# Altium project ANALOG_BOARD.PrjPcb
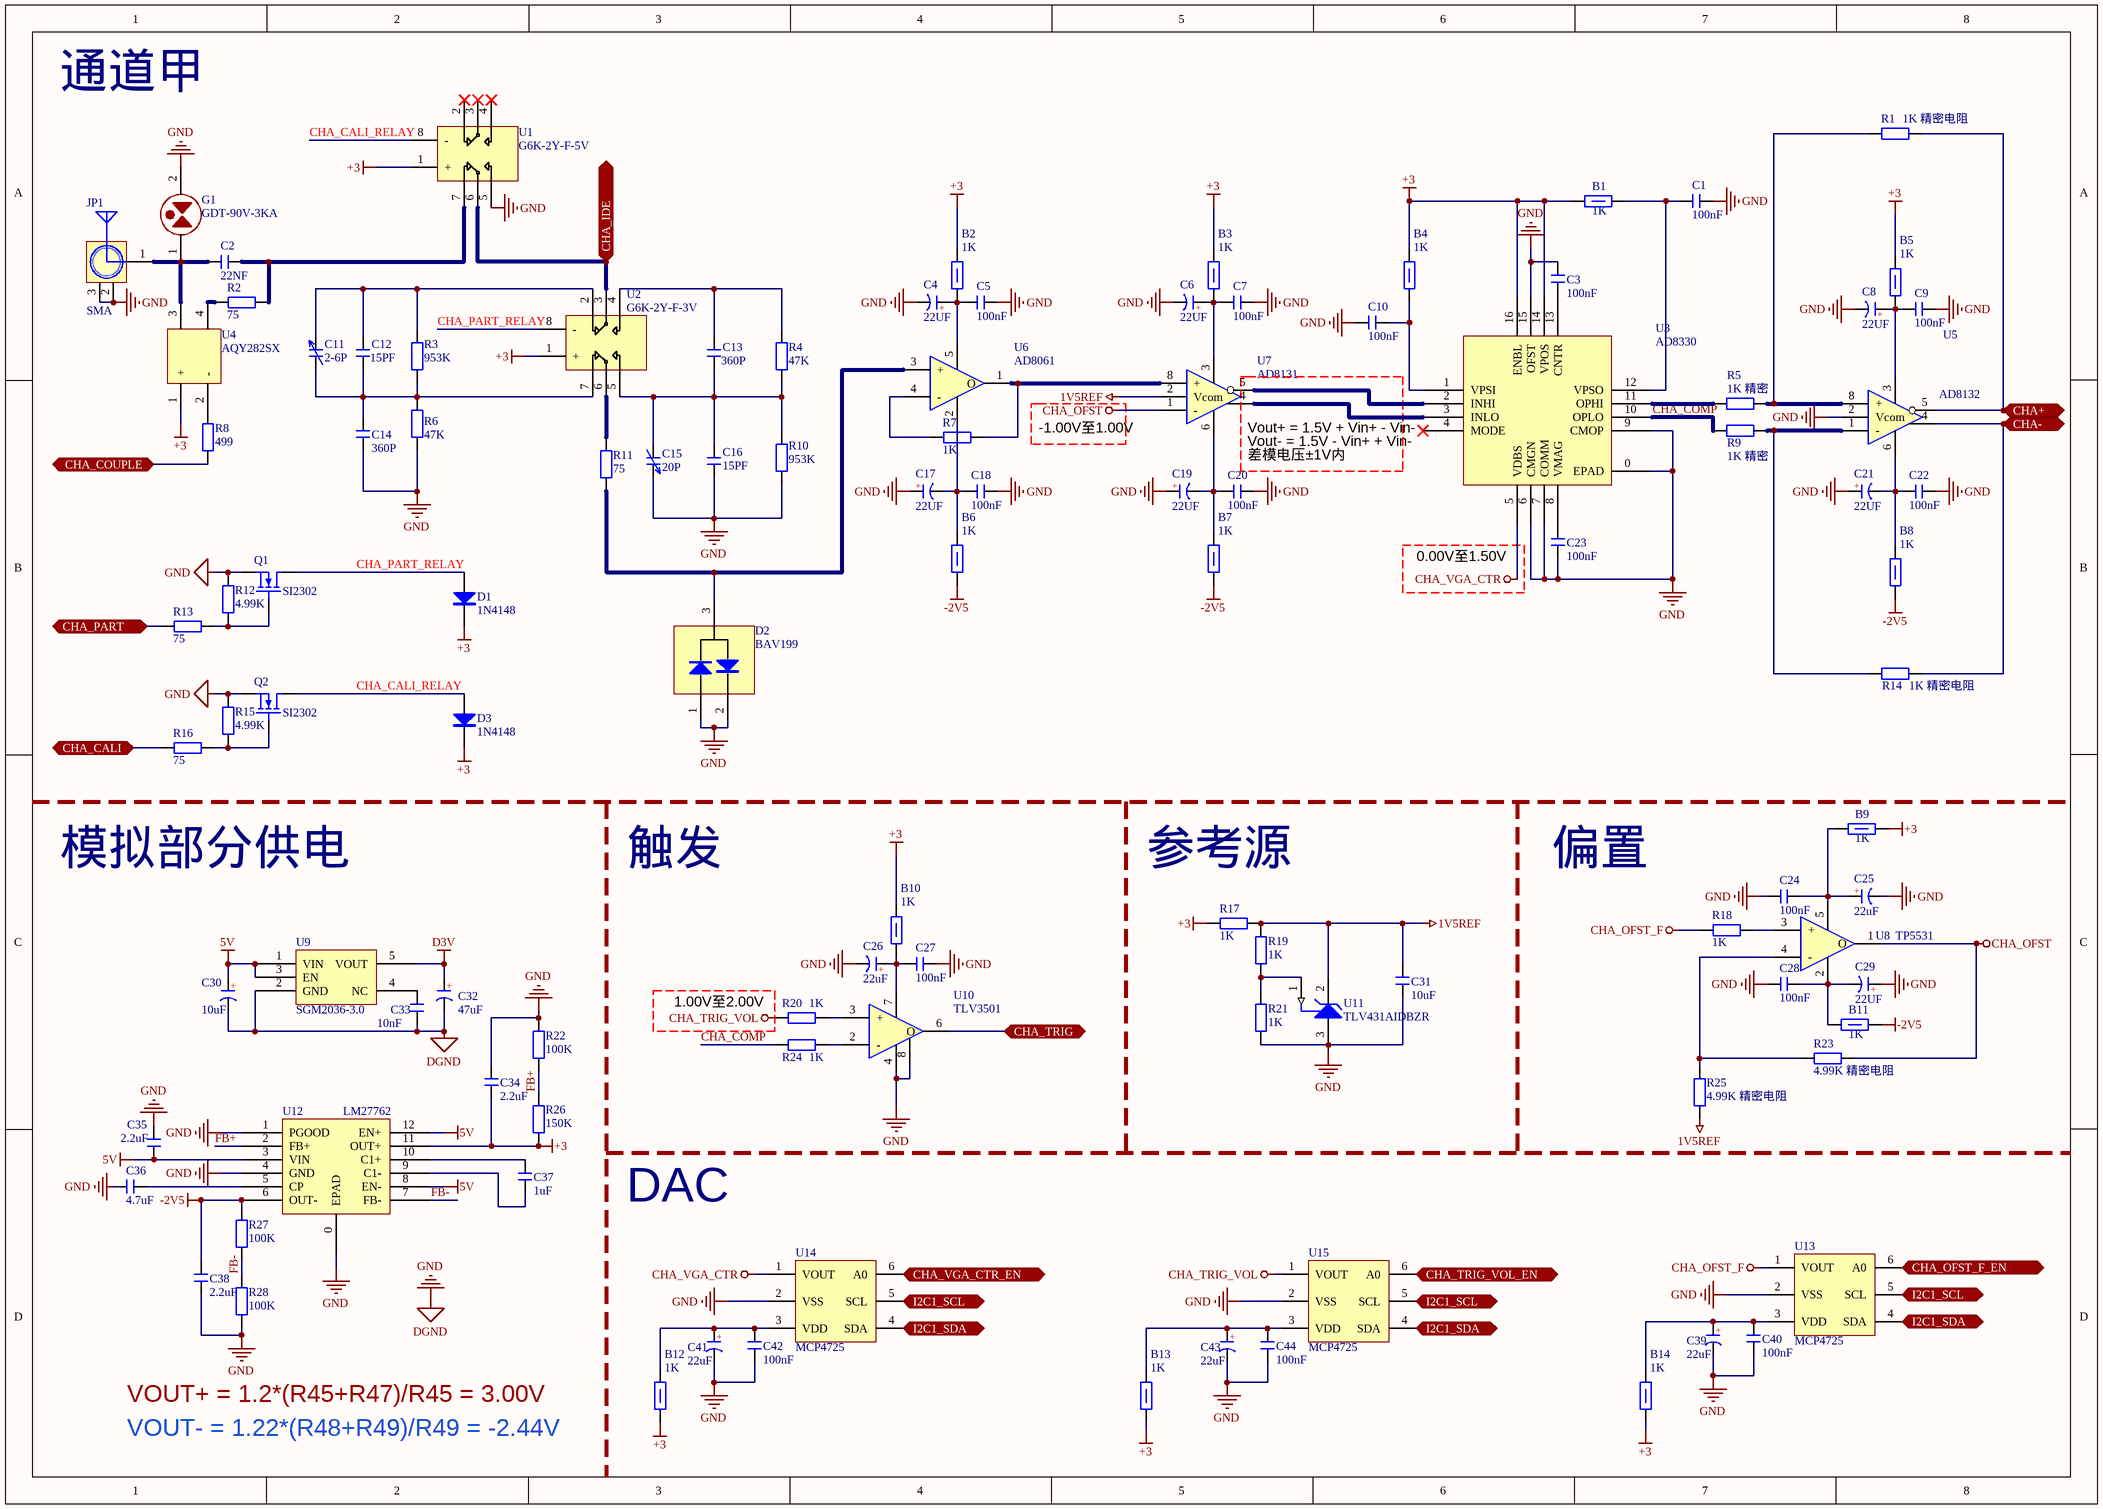
[diagram p0: ANALOG_PART1.SchDoc]
3 sheets, 241 parts. Net scope: flat (ports and power ports of the same name join across sheets).
Board file: ANALOG_BOARD.PcbDoc
Sheets:
  ANALOG_PART1.SchDoc
  ANALOG_PART2.SchDoc
  AtoD_PART.SchDoc

## Sheet ANALOG_PART1.SchDoc
size A3; SheetNumber: 1; SheetTotal: 3

### Parts
B1  1K  [B 0603_L]
B2  1K  [B 0603_L]
B3  1K  [B 0603_L]
B4  1K  [B 0603_L]
B5  1K  [B 0603_L]
B6  1K  [B 0603_L]
B7  1K  [B 0603_L]
B8  1K  [B 0603_L]
B9  1K  [B 0603_L]
B10  1K  [B 0603_L]
B11  1K  [B 0603_L]
B12  1K  [B 0603_L]
B13  1K  [B 0603_L]
B14  1K  [B 0603_L]
C1  100nF  [C 0603_L]
C2  22NF  [C 1206_L]
C3  100nF  [C 0603_L]
C4  22UF  [C 0603_L]
C5  100nF  [C 0603_L]
C6  22UF  [C 0603_L]
C7  100nF  [C 0603_L]
C8  22UF  [C 0603_L]
C9  100nF  [C 0603_L]
C10  100nF  [C 0603_L]
C11  2-6P  [RC-SMD]
C12  15PF  [C 0603_L]
C13  360P  [C 0603_L]
C14  360P  [C 0603_L]
C15  20P  [RC-SMD]
C16  15PF  [C 0603_L]
C17  22UF  [C 0603_L]
C18  100nF  [C 0603_L]
C19  22UF  [C 0603_L]
C20  100nF  [C 0603_L]
C21  22UF  [C 0603_L]
C22  100nF  [C 0603_L]
C23  100nF  [C 0603_L]
C24  100nF  [C 0603_L]
C25  22uF  [C 0603_L]
C26  22uF  [C 0603_L]
C27  100nF  [C 0603_L]
C28  100nF  [C 0603_L]
C29  22UF  [C 0603_L]
C30  10uF  [CD A(3216)]
C31  10uF  [C 0603_L]
C32  47uF  [CD A(3216)]
C33  10nF  [C 0603_L]
C34  2.2uF  [C 0603_L]
C35  2.2uF  [C 0603_L]
C36  4.7uF  [C 0603_L]
C37  1uF  [C 0603_L]
C38  2.2uF  [C 0603_L]
C39  22uF  [C 0603_L]
C40  100nF  [C 0603_L]
C41  22uF  [C 0603_L]
C42  100nF  [C 0603_L]
C43  22uF  [C 0603_L]
C44  100nF  [C 0603_L]
D1  1N4148  [SOD-523_L]
D2  BAV199  [SOT23-3L]
D3  1N4148  [SOD-523_L]
G1  GDT-90V-3KA  [GDT-1812]
JP1  SMA  [SMA_FR]
Q1  SI2302  [SOT23-3L]
Q2  SI2302  [SOT23-3L]
R1  1K 精密电阻  [R 0603_L]
R2  75  [R 0603_L]
R3  953K  [R 0603_L]
R4  47K  [R 0603_L]
R5  1K 精密  [R 0603_L]
R6  47K  [R 0603_L]
R7  1K  [R 0603_L]
R8  499  [R 0603_L]
R9  1K 精密  [R 0603_L]
R10  953K  [R 0603_L]
R11  75  [R 0603_L]
R12  4.99K  [R 0603_L]
R13  75  [R 0603_L]
R14  1K 精密电阻  [R 0603_L]
R15  4.99K  [R 0603_L]
R16  75  [R 0603_L]
R17  1K  [R 0603_L]
R18  1K  [R 0603_L]
R19  1K  [R 0603_L]
R20  1K  [R 0603_L]
R21  1K  [R 0603_L]
R22  100K  [R 0603_L]
R23  4.99K 精密电阻  [R 0603_L]
R24  1K  [R 0603_L]
R25  4.99K 精密电阻  [R 0603_L]
R26  150K  [R 0603_L]
R27  100K  [R 0603_L]
R28  100K  [R 0603_L]
U1  G6K-2Y-F-5V  [G6K-2F-Y]
U2  G6K-2Y-F-3V  [G6K-2F-Y]
U3  AD8330  [LFCSP-16]
U4  AQY282SX  [SOP4_L]
U5  AD8132  [SOP8_L]
U6  AD8061  [SOT23-5]
U7  AD8131  [SOP8_L]
U8  TP5531  [SOT23-5]
U9  SGM2036-3.0  [SOT23-5L]
U10  TLV3501  [SOP8_L]
U11  TLV431AIDBZR  [DBZ0003A_N]
U12  LM27762  [WSON-12]
U13  MCP4725  [SOT23-6L]
U14  MCP4725  [SOT23-6L]
U15  MCP4725  [SOT23-6L]

### Ports
CHA+ (bidir), CHA- (bidir), CHA_CALI (bidir), CHA_COUPLE (bidir), CHA_IDE (bidir), CHA_OFST_F_EN (bidir), CHA_PART (bidir), CHA_TRIG (bidir), CHA_TRIG_VOL_EN (bidir), CHA_VGA_CTR_EN (bidir), I2C1_SCL (bidir), I2C1_SDA (bidir)

### Nets
1V5REF: C31.1 R17.2 R19.2 R25.2 U7.2(Vcom) U11.2(CATHODE)
5V: C30.1(A) C35.2 U9.1(VIN) U9.3(EN) U12.3(VIN) U12.8(EN-) U12.12(EN+)
+3: B1.1 B2.2 B3.2 B4.2 B5.2 B9.2 B10.2 B12.1 B13.1 B14.1 C34.1 D1.2(K) D3.2(K) R17.1 R26.1 U1.1(+) U2.1(+) U3.14(VPOS) U3.16(ENBL) U4.1(+) U12.11(OUT+)
-2V5: B6.1 B7.1 B8.1 B11.2 C38.1 R27.1 U12.6(OUT-)
CHA_OFST: R23.2 U7.1(-) U8.1(O)
CHA_OFST_F: R18.2 U13.1(VOUT)
CHA_TRIG_VOL: R20.1 U15.1(VOUT)
CHA_VGA_CTR: U3.5(VDBS) U14.1(VOUT)
D3V: C32.1(A) U9.5(VOUT)
DGND: C1.1 C3.1 C4.2(K) C5.1 C6.2(K) C7.1 C8.2(K) C9.1 C10.2 C14.1 C15.2 C16.1 C17.1(A) C18.1 C19.1(A) C20.1 C21.1(A) C22.1 C23.2 C24.2 C25.2(K) C26.2(K) C27.1 C28.2 C29.1(A) C30.2(K) C31.2 C32.2(K) C33.1 C34.2 C35.1 C36.1 C38.2 C39.2(K) C40.2 C41.2(K) C42.2 C43.2(K) C44.2 D2.1 D2.2 G1.2 JP1.2(GND) JP1.3(GND) Q1.2 Q2.2 R6.1 R10.1 R12.2 R15.2 R21.1 R22.2 R28.2 U1.5 U3.0(EPAD) U3.6(CMGN) U3.7(COMM) U3.9(CMOP) U3.15(OFST) U5.2(Vcom) U9.2(GND) U10.4 U10.8 U11.3(ANODE) U12.0(EPAD) U12.1(PGOOD) U12.4(GND) U13.2(VSS) U14.2(VSS) U15.2(VSS)  [also labelled GND]
CHA_CALI_RELAY: D3.1(A) Q2.3 U1.8(-)
CHA_COMP: R9.1 R24.1 U3.10(OPLO)
CHA_N: R14.2 U5.4 ; port CHA-
CHA_P: R1.2 U5.5 ; port CHA+
CHA_PART_RELAY: D1.1(A) Q1.3 U2.8(-)
FB+: R22.1 R26.2 U12.2(FB+)
FB-: R27.2 R28.1 U12.7(FB-)
Net1_15: U13.4(SDA) U14.4(SDA) U15.4(SDA) ; port I2C1_SDA
Net1_16: U13.5(SCL) U14.5(SCL) U15.5(SCL) ; port I2C1_SCL
Net1_25: U10.6(O) ; port CHA_TRIG
Net1_30: R16.2 ; port CHA_CALI
Net1_31: R8.1 ; port CHA_COUPLE
Net1_32: R13.2 ; port CHA_PART
NetB1_2: B1.2 C1.2 U3.12(VPSO)
NetB2_1: B2.1 C4.1(A) C5.2 U6.5
NetB3_1: B3.1 C6.1(A) C7.2 U7.3
NetB4_1: B4.1 C10.1 U3.1(VPSI)
NetB5_1: B5.1 C8.1(A) C9.2 U5.3
NetB6_2: B6.2 C17.2(K) C18.2 U6.2
NetB7_2: B7.2 C19.2(K) C20.2 U7.6
NetB8_2: B8.2 C21.2(K) C22.2 U5.6
NetB9_1: B9.1 C24.1 C25.1(A) U8.5
NetB10_1: B10.1 C26.1(A) C27.2 U10.7
NetB11_1: B11.1 C28.1 C29.2(K) U8.2
NetB12_2: B12.2 C41.1(A) C42.1 U14.3(VDD)
NetB13_2: B13.2 C43.1(A) C44.1 U15.3(VDD)
NetB14_2: B14.2 C39.1(A) C40.1 U13.3(VDD)
NetC2_1: C2.1 G1.1 JP1.1(ANT) U4.3
NetC2_2: C2.2 R2.2 U1.7
NetC3_2: C3.2 U3.13(CNTR)
NetC11_1: C11.1 C12.1 C14.2 R3.1 R6.2 U2.7
NetC11_2: C11.2 C12.2 R3.2 U2.2
NetC13_1: C13.1 C15.1 C16.2 R4.1 R10.2 U2.5
NetC13_2: C13.2 R4.2 U2.4
NetC23_1: C23.1 U3.8(VMAG)
NetC33_2: C33.2 U9.4(NC)
NetC36_2: C36.2 U12.5(CP)
NetC37_1: C37.1 U12.10(C1+)
NetC37_2: C37.2 U12.9(C1-)
NetD2_3: D2.3 R11.1 U6.3(+)
NetIC1_13: U13.6(A0) ; port CHA_OFST_F_EN
NetIC1_14: U15.6(A0) ; port CHA_TRIG_VOL_EN
NetIC1_15: U14.6(A0) ; port CHA_VGA_CTR_EN
NetQ1_1: Q1.1 R12.1 R13.1
NetQ2_1: Q2.1 R15.1 R16.1
NetR1_1: R1.1 R5.2 U5.8(+)
NetR2_1: R2.1 U4.4
NetR5_1: R5.1 U3.11(OPHI)
NetR7_1: R7.1 U6.1(O) U7.8(+)
NetR7_2: R7.2 U6.4(-)
NetR8_2: R8.2 U4.2(-)
NetR9_2: R9.2 R14.1 U5.1(-)
NetR11_2: R11.2 U2.6
NetR18_1: R18.1 U8.3(+)
NetR19_1: R19.1 R21.2 U11.1(REF)
NetR20_2: R20.2 U10.3(+)
NetR23_1: R23.1 R25.1 U8.4(-)
NetR24_2: R24.2 U10.2(-)
NetU1_6: U1.6 U2.3 ; port CHA_IDE
NetU3_2: U3.2(INHI) U7.5
NetU3_3: U3.3(INLO) U7.4

Not connected (* = marked no-connect by the designer): U1 2* 3* 4*; U3 4(MODE)*

### Notes on the sheet
- 通道甲
- -1.00V至1.00V
- Vout+ = 1.5V + Vin+ - Vin-
- Vout- = 1.5V - Vin+ + Vin-
- 差模电压±1V内
- 0.00V至1.50V
- 模拟部分供电
- 触发
- 参考源
- 偏置
- 1.00V至2.00V
- DAC
- VOUT- = 1.22*(R48+R49)/R49 = -2.44V
- VOUT+ = 1.2*(R45+R47)/R45 = 3.00V
- (in symbol C-CD) +

### Library data of the parts
B1-B14 = B: 贴片磁珠
C1-C3 C5 C7 C9 C10 C12-C14 C16 C18 C20 C22-C24 C27 C28 C31 C33-C38 C40 C42 C44 = C: 无极性贴片电容; 版权归属: 源创客; BOM名称: 无极性贴片电容; 学习资源: www.ooocke.com
C4 C6 C8 C17 C19 C21 C25 C26 C29 C30 C32 C39 C41 C43 = C-CD: 贴片钽电容; 版权归属: 源创客; BOM名称: 贴片钽电容; 学习资源: www.ooocke.com
C11 C15 = CP_SMD: 贴片可调电容
D1 D3 = 1N4148: 高速开关二极管; 版权归属: 源创客; BOM名称: 高速开关二极管; 学习资源: www.ooocke.com
D2 = BAV199: 双肖特基二极管; BOM名称: 肖特基二极管; 版权归属: 源创客; 属性: 40V/2A; 学习资源: www.ooocke.com
G1 = GDT-90V-3KA: 气体放电管
JP1 = SMA: SMA-2.4G射频天线接口; 版权归属: 源创客; BOM名称: SMA-2.4G射频天线接口; 学习资源: www.ooocke.com
Q1 Q2 = SI2302: 场效应管
R1-R28 = R: 贴片电阻; 版权归属: 源创客; BOM名称: 贴片电阻; 学习资源: www.ooocke.com
U1 U2 = G6K-2Y-F-5V: 继电器
U3 = AD8330: 压控放大器
U4 = AQY282SX: 光电固态继电器
U5 = AD8132: 全差分运放; BOM名称: 单路精密运放; 版权归属: 源创客; 学习资源: www.ooocke.com
U6 = AD8061: FET输入运放; BOM名称: 单路精密运放; 版权归属: 源创客; 学习资源: www.ooocke.com
U7 = AD8131: 全差分运放; BOM名称: 单路精密运放; 版权归属: 源创客; 学习资源: www.ooocke.com
U8 = TP5531: 零漂运放; BOM名称: 单路精密运放; 版权归属: 源创客; 学习资源: www.ooocke.com
U9 = SP6201-3.3: 线性稳压器
U10 = TLV3501: 高速比较器; BOM名称: 单路精密运放; 版权归属: 源创客; 学习资源: www.ooocke.com
U11 = CMP-0366-00975-2: Low Voltage Adjustable Precision Shunt Regulator, 39 ppm / degC, 15 mA, -40 to 85 degC, 3-pin SOT-23 (DBZ), Green (RoHS & no Sb/Br); Manufacturer: Texas Instruments; Temp Coeff(Typ)(ppm/ degree C): 39; VO Adj(Max)(V): 6; SubFamily: Shunt Voltage Reference; Min Iz for Regulation(uA): 80; Temp Coeff(Max)(ppm/ degree C): 129; VO Adj(Min)(V): 1.24; Initial Accuracy @ 25/deg C(%): 1; Iout/Iz(Max)(mA): 15; Rating: Catalog; ComponentLink1URL: http://www.ti.com/; ComponentLink2URL: http://www.ti.com/general/docs/lit/getliterature.tsp?genericPartNumber=TLV431A&fileType=pdf; Mounting Technology: Surface Mount; DatasheetVersion: SLVS139T; ComponentLink3URL: http://www.ti.com/litv/pdf/mpds108a; PackageDescription: 3-Pin Plastic Small Outline, Body 2.92 x 1.3 mm, Pitch 0.95 mm; Code_JEDEC: TO-236; Eco-Plan: Green (RoHS & no Sb/Br); ComponentLink2Description: Datasheet; PackageReference: DBZ0003A; PackageVersion: 4203227/B; ComponentLink3Description: Package Specification; PartNumber: TLV431AIDBZR; ComponentLink1Description: Manufacturer URL
U12 = LM27762: DC-DC电源芯片
U13-U15 = MCP4725: 单通道DAC

## Sheet ANALOG_PART2.SchDoc
size A3; SheetNumber: 2; SheetTotal: 3
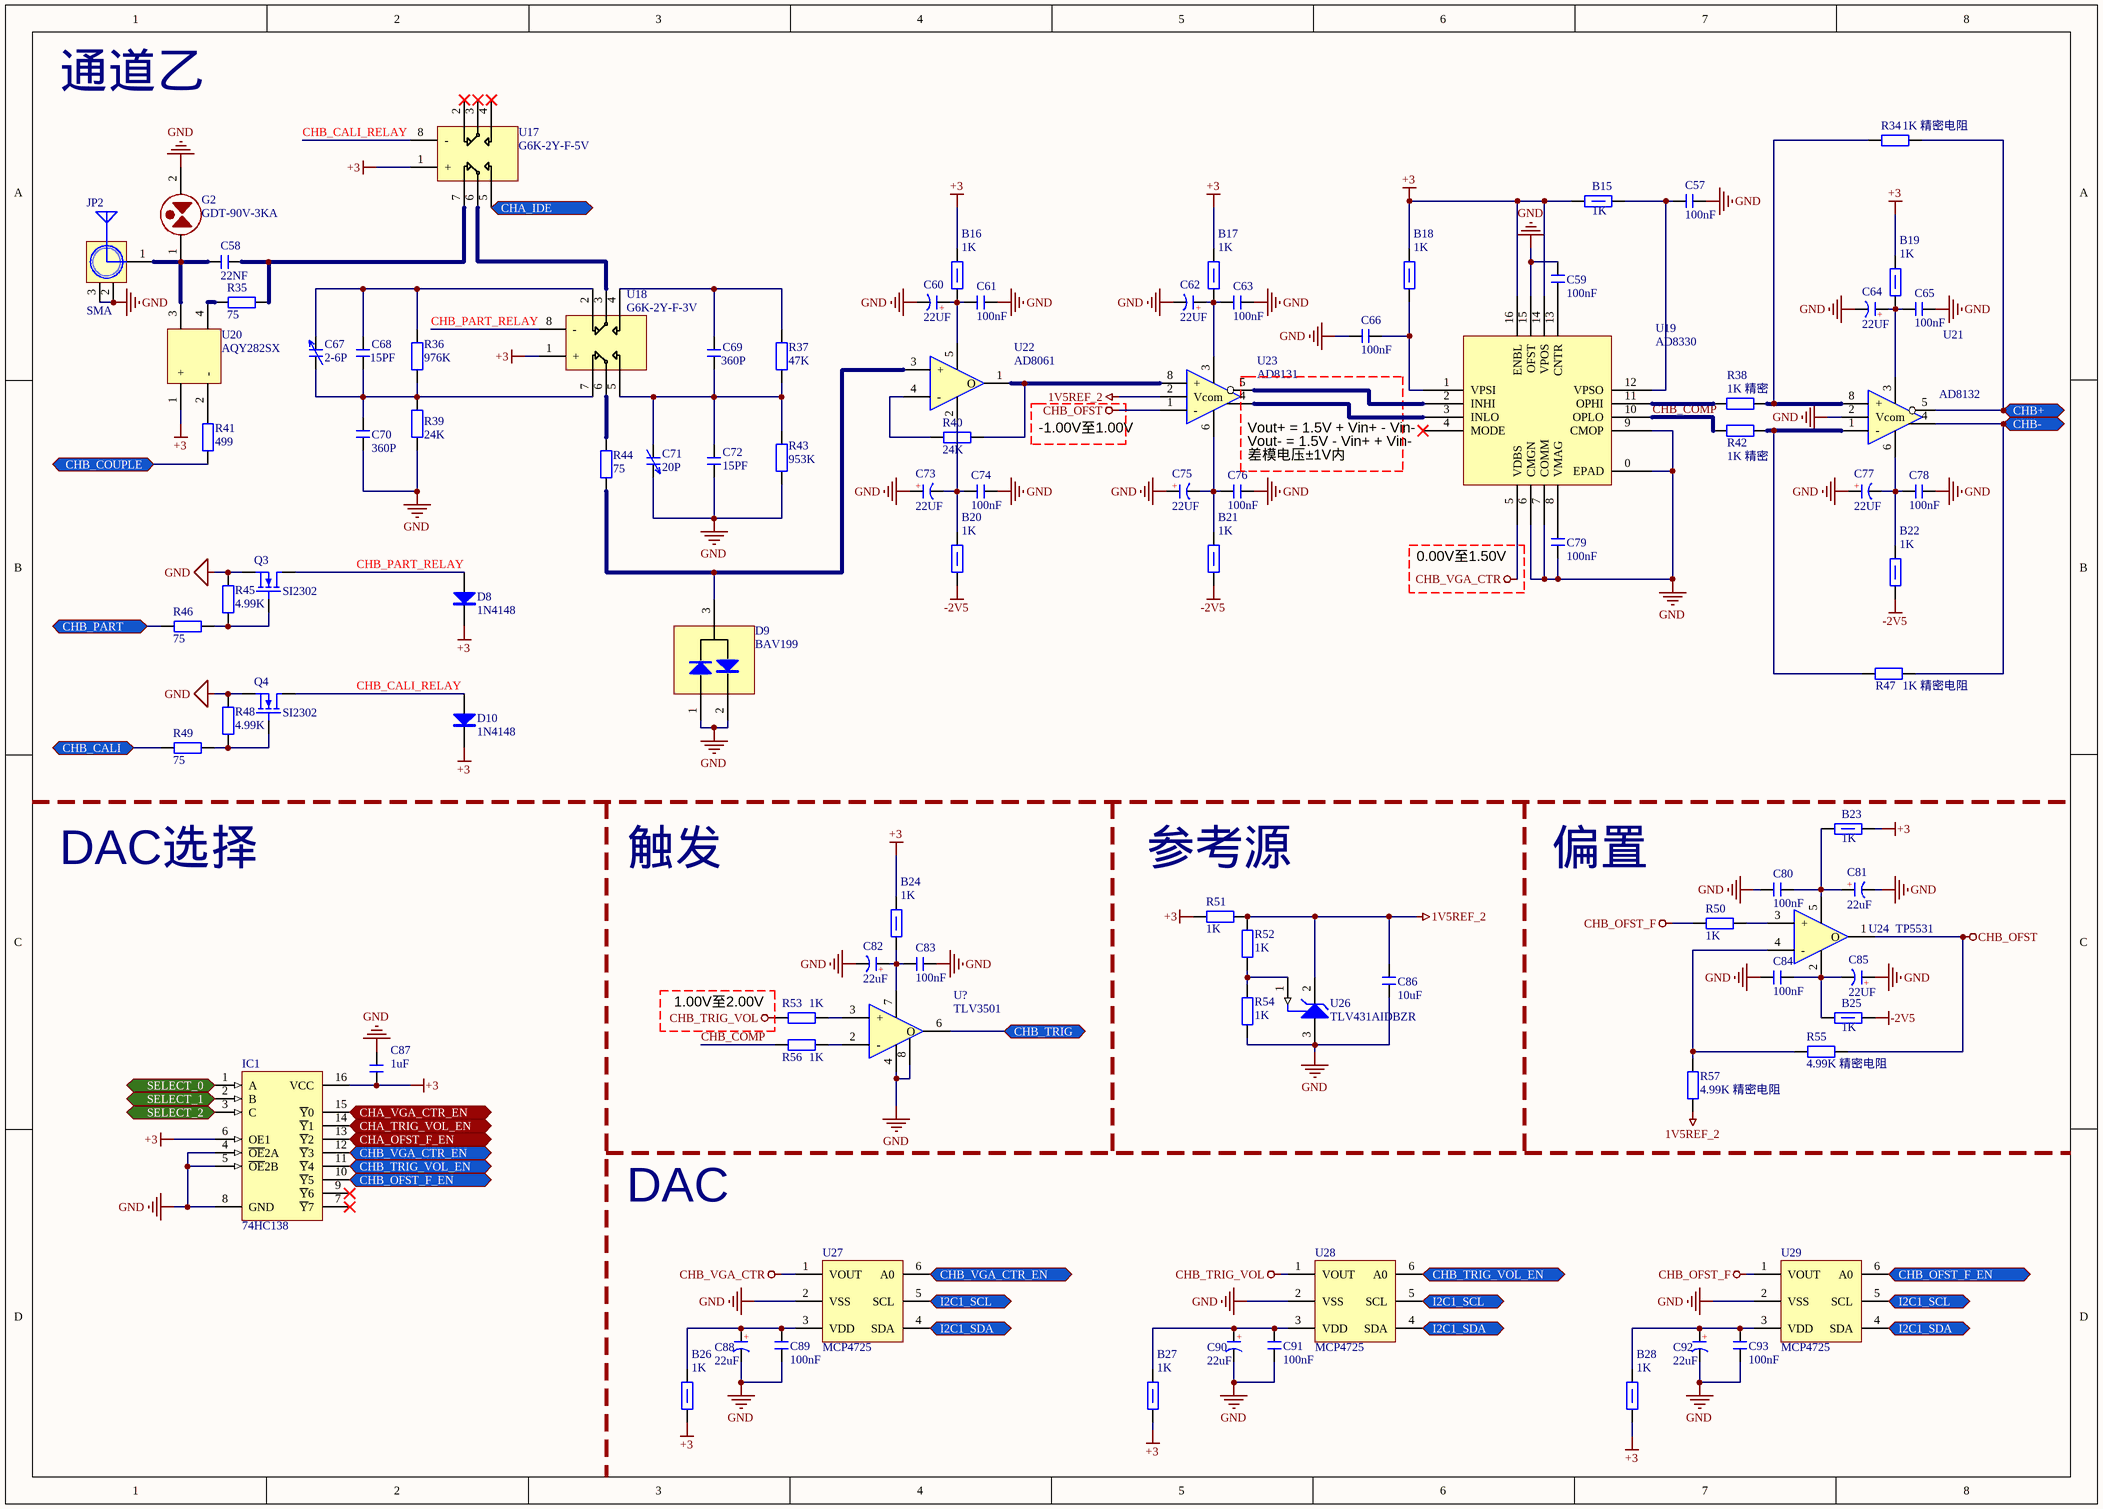
[diagram p1: ANALOG_PART2.SchDoc]

### Parts
B15  1K  [B 0603_L]
B16  1K  [B 0603_L]
B17  1K  [B 0603_L]
B18  1K  [B 0603_L]
B19  1K  [B 0603_L]
B20  1K  [B 0603_L]
B21  1K  [B 0603_L]
B22  1K  [B 0603_L]
B23  1K  [B 0603_L]
B24  1K  [B 0603_L]
B25  1K  [B 0603_L]
B26  1K  [B 0603_L]
B27  1K  [B 0603_L]
B28  1K  [B 0603_L]
C57  100nF  [C 0603_L]
C58  22NF  [C 1206_L]
C59  100nF  [C 0603_L]
C60  22UF  [C 0603_L]
C61  100nF  [C 0603_L]
C62  22UF  [C 0603_L]
C63  100nF  [C 0603_L]
C64  22UF  [C 0603_L]
C65  100nF  [C 0603_L]
C66  100nF  [C 0603_L]
C67  2-6P  [RC-SMD]
C68  15PF  [C 0603_L]
C69  360P  [C 0603_L]
C70  360P  [C 0603_L]
C71  20P  [RC-SMD]
C72  15PF  [C 0603_L]
C73  22UF  [C 0603_L]
C74  100nF  [C 0603_L]
C75  22UF  [C 0603_L]
C76  100nF  [C 0603_L]
C77  22UF  [C 0603_L]
C78  100nF  [C 0603_L]
C79  100nF  [C 0603_L]
C80  100nF  [C 0603_L]
C81  22uF  [C 0603_L]
C82  22uF  [C 0603_L]
C83  100nF  [C 0603_L]
C84  100nF  [C 0603_L]
C85  22UF  [C 0603_L]
C86  10uF  [C 0603_L]
C87  1uF  [C 0603_L]
C88  22uF  [C 0603_L]
C89  100nF  [C 0603_L]
C90  22uF  [C 0603_L]
C91  100nF  [C 0603_L]
C92  22uF  [C 0603_L]
C93  100nF  [C 0603_L]
D8  1N4148  [SOD-523_L]
D9  BAV199  [SOT23-3L]
D10  1N4148  [SOD-523_L]
G2  GDT-90V-3KA  [GDT-1812]
IC1  74HC138  [TSSOP16_L]
JP2  SMA  [SMA_FR]
Q3  SI2302  [SOT23-3L]
Q4  SI2302  [SOT23-3L]
R34  1K 精密电阻  [R 0603_L]
R35  75  [R 0603_L]
R36  976K  [R 0603_L]
R37  47K  [R 0603_L]
R38  1K 精密  [R 0603_L]
R39  24K  [R 0603_L]
R40  24K  [R 0603_L]
R41  499  [R 0603_L]
R42  1K 精密  [R 0603_L]
R43  953K  [R 0603_L]
R44  75  [R 0603_L]
R45  4.99K  [R 0603_L]
R46  75  [R 0603_L]
R47  1K 精密电阻  [R 0603_L]
R48  4.99K  [R 0603_L]
R49  75  [R 0603_L]
R50  1K  [R 0603_L]
R51  1K  [R 0603_L]
R52  1K  [R 0603_L]
R53  1K  [R 0603_L]
R54  1K  [R 0603_L]
R55  4.99K 精密电阻  [R 0603_L]
R56  1K  [R 0603_L]
R57  4.99K 精密电阻  [R 0603_L]
U17  G6K-2Y-F-5V  [G6K-2F-Y]
U18  G6K-2Y-F-3V  [G6K-2F-Y]
U19  AD8330  [LFCSP-16]
U20  AQY282SX  [SOP4_L]
U21  AD8132  [SOP8_L]
U22  AD8061  [SOT23-5]
U23  AD8131  [SOP8_L]
U24  TP5531  [SOT23-5]
U26  TLV431AIDBZR  [DBZ0003A_N]
U27  MCP4725  [SOT23-6L]
U28  MCP4725  [SOT23-6L]
U29  MCP4725  [SOT23-6L]
U?  TLV3501  [SOP8_L]

### Ports
CHA_IDE (bidir), CHA_OFST_F_EN (bidir), CHA_TRIG_VOL_EN (bidir), CHA_VGA_CTR_EN (bidir), CHB+ (bidir), CHB- (bidir), CHB_CALI (bidir), CHB_COUPLE (bidir), CHB_OFST_F_EN (bidir), CHB_PART (bidir), CHB_TRIG (bidir), CHB_TRIG_VOL_EN (bidir), CHB_VGA_CTR_EN (bidir), I2C1_SCL (bidir), I2C1_SDA (bidir), SELECT_0 (bidir), SELECT_1 (bidir), SELECT_2 (bidir)

### Nets
1V5REF_2: C86.1 R51.2 R52.2 R57.2 U23.2(Vcom) U26.2(CATHODE)
+3: B15.1 B16.2 B17.2 B18.2 B19.2 B23.2 B24.2 B26.1 B27.1 B28.1 C87.2 D8.2(K) D10.2(K) IC1.6(OE1) IC1.16(VCC) R51.1 U17.1(+) U18.1(+) U19.14(VPOS) U19.16(ENBL) U20.1(+)
-2V5: B20.1 B21.1 B22.1 B25.2
CHB_OFST: R55.2 U23.1(-) U24.1(O)
CHB_OFST_F: R50.2 U29.1(VOUT)
CHB_TRIG_VOL: R53.1 U28.1(VOUT)
CHB_VGA_CTR: U19.5(VDBS) U27.1(VOUT)
GND: C57.1 C59.1 C60.2(K) C61.1 C62.2(K) C63.1 C64.2(K) C65.1 C66.2 C70.1 C71.2 C72.1 C73.1(A) C74.1 C75.1(A) C76.1 C77.1(A) C78.1 C79.2 C80.2 C81.2(K) C82.2(K) C83.1 C84.2 C85.1(A) C86.2 C87.1 C88.2(K) C89.2 C90.2(K) C91.2 C92.2(K) C93.2 D9.1 D9.2 G2.2 IC1.4(~{OE}2A) IC1.5(~{OE}2B) IC1.8(GND) JP2.2(GND) JP2.3(GND) Q3.2 Q4.2 R39.1 R43.1 R45.2 R48.2 R54.1 U19.0(EPAD) U19.6(CMGN) U19.7(COMM) U19.9(CMOP) U19.15(OFST) U21.2(Vcom) U26.3(ANODE) U27.2(VSS) U28.2(VSS) U29.2(VSS) U?.4 U?.8  [project net DGND]
CHB_CALI_RELAY: D10.1(A) Q4.3 U17.8(-)
CHB_COMP: R42.1 R56.1 U19.10(OPLO)
CHB_N: R47.2 U21.4 ; port CHB-
CHB_P: R34.2 U21.5 ; port CHB+
CHB_PART_RELAY: D8.1(A) Q3.3 U18.8(-)
Net1_15: U27.4(SDA) U28.4(SDA) U29.4(SDA) ; port I2C1_SDA
Net1_16: U27.5(SCL) U28.5(SCL) U29.5(SCL) ; port I2C1_SCL
Net1_17: R46.2 ; port CHB_PART
Net1_18: R41.1 ; port CHB_COUPLE
Net1_26: U?.6(O) ; port CHB_TRIG
Net1_27: R49.2 ; port CHB_CALI
Net1_35: IC1.3(C) ; port SELECT_2
Net1_36: IC1.2(B) ; port SELECT_1
Net1_37: IC1.1(A) ; port SELECT_0
NetB15_2: B15.2 C57.2 U19.12(VPSO)
NetB16_1: B16.1 C60.1(A) C61.2 U22.5
NetB17_1: B17.1 C62.1(A) C63.2 U23.3
NetB18_1: B18.1 C66.1 U19.1(VPSI)
NetB19_1: B19.1 C64.1(A) C65.2 U21.3
NetB20_2: B20.2 C73.2(K) C74.2 U22.2
NetB21_2: B21.2 C75.2(K) C76.2 U23.6
NetB22_2: B22.2 C77.2(K) C78.2 U21.6
NetB23_1: B23.1 C80.1 C81.1(A) U24.5
NetB24_1: B24.1 C82.1(A) C83.2 U?.7
NetB25_1: B25.1 C84.1 C85.2(K) U24.2
NetB26_2: B26.2 C88.1(A) C89.1 U27.3(VDD)
NetB27_2: B27.2 C90.1(A) C91.1 U28.3(VDD)
NetB28_2: B28.2 C92.1(A) C93.1 U29.3(VDD)
NetC58_1: C58.1 G2.1 JP2.1(ANT) U20.3
NetC58_2: C58.2 R35.2 U17.7
NetC59_2: C59.2 U19.13(CNTR)
NetC67_1: C67.1 C68.1 C70.2 R36.1 R39.2 U18.7
NetC67_2: C67.2 C68.2 R36.2 U18.2
NetC69_1: C69.1 C71.1 C72.2 R37.1 R43.2 U18.5
NetC69_2: C69.2 R37.2 U18.4
NetC79_1: C79.1 U19.8(VMAG)
NetD9_3: D9.3 R44.1 U22.3(+)
NetIC1_10: IC1.10(~{Y}5) U29.6(A0) ; port CHB_OFST_F_EN
NetIC1_11: IC1.11(~{Y}4) U28.6(A0) ; port CHB_TRIG_VOL_EN
NetIC1_12: IC1.12(~{Y}3) U27.6(A0) ; port CHB_VGA_CTR_EN
NetIC1_13: IC1.13(~{Y}2) ; port CHA_OFST_F_EN
NetIC1_14: IC1.14(~{Y}1) ; port CHA_TRIG_VOL_EN
NetIC1_15: IC1.15(~{Y}0) ; port CHA_VGA_CTR_EN
NetQ3_1: Q3.1 R45.1 R46.1
NetQ4_1: Q4.1 R48.1 R49.1
NetR34_1: R34.1 R38.2 U21.8(+)
NetR35_1: R35.1 U20.4
NetR38_1: R38.1 U19.11(OPHI)
NetR40_1: R40.1 U22.1(O) U23.8(+)
NetR40_2: R40.2 U22.4(-)
NetR41_2: R41.2 U20.2(-)
NetR42_2: R42.2 R47.1 U21.1(-)
NetR44_2: R44.2 U18.6
NetR50_1: R50.1 U24.3(+)
NetR52_1: R52.1 R54.2 U26.1(REF)
NetR53_2: R53.2 U?.3(+)
NetR55_1: R55.1 R57.1 U24.4(-)
NetR56_2: R56.2 U?.2(-)
NetU1_6: U17.5 ; port CHA_IDE
NetU17_6: U17.6 U18.3
NetU19_2: U19.2(INHI) U23.5
NetU19_3: U19.3(INLO) U23.4

Not connected (* = marked no-connect by the designer): IC1 7(~{Y}7)* 9(~{Y}6)*; U17 2* 3* 4*; U19 4(MODE)*

### Notes on the sheet
- 通道乙
- -1.00V至1.00V
- Vout+ = 1.5V + Vin+ - Vin-
- Vout- = 1.5V - Vin+ + Vin-
- 差模电压±1V内
- 0.00V至1.50V
- DAC选择
- 触发
- 参考源
- 偏置
- 1.00V至2.00V
- DAC
- (in symbol C-CD) +

### Library data of the parts
B15-B28 = B: 贴片磁珠
C57-C59 C61 C63 C65 C66 C68-C70 C72 C74 C76 C78-C80 C83 C84 C86 C87 C89 C91 C93 = C: 无极性贴片电容; 版权归属: 源创客; BOM名称: 无极性贴片电容; 学习资源: www.ooocke.com
C60 C62 C64 C73 C75 C77 C81 C82 C85 C88 C90 C92 = C-CD: 贴片钽电容; 版权归属: 源创客; BOM名称: 贴片钽电容; 学习资源: www.ooocke.com
C67 C71 = CP_SMD: 贴片可调电容
D8 D10 = 1N4148: 高速开关二极管; 版权归属: 源创客; BOM名称: 高速开关二极管; 学习资源: www.ooocke.com
D9 = BAV199: as D2 on sheet ANALOG_PART1; 学习资源: www.ooocke.com
G2 = GDT-90V-3KA: 气体放电管
IC1 = 74HC138: 138译码器; 版权归属: 源创客; 学习资源: www.ooocke.com; BOM名称: 138译码器
JP2 = SMA: SMA-2.4G射频天线接口; 版权归属: 源创客; BOM名称: SMA-2.4G射频天线接口; 学习资源: www.ooocke.com
Q3 Q4 = SI2302: 场效应管
R34-R57 = R: 贴片电阻; 版权归属: 源创客; BOM名称: 贴片电阻; 学习资源: www.ooocke.com
U17 U18 = G6K-2Y-F-5V: 继电器
U19 = AD8330: 压控放大器
U20 = AQY282SX: 光电固态继电器
U21 = AD8132: 全差分运放; BOM名称: 单路精密运放; 版权归属: 源创客; 学习资源: www.ooocke.com
U22 = AD8061: FET输入运放; BOM名称: 单路精密运放; 版权归属: 源创客; 学习资源: www.ooocke.com
U23 = AD8131: 全差分运放; BOM名称: 单路精密运放; 版权归属: 源创客; 学习资源: www.ooocke.com
U24 = TP5531: 零漂运放; BOM名称: 单路精密运放; 版权归属: 源创客; 学习资源: www.ooocke.com
U26 = CMP-0366-00975-2: as U11 on sheet ANALOG_PART1; ComponentLink1URL: http://www.ti.com/; ComponentLink2URL: http://www.ti.com/general/docs/lit/getliterature.tsp?genericPartNumber=TLV431A&fileType=pdf; Mounting Technology: Surface Mount; DatasheetVersion: SLVS139T; ComponentLink3URL: http://www.ti.com/litv/pdf/mpds108a; PackageDescription: 3-Pin Plastic Small Outline, Body 2.92 x 1.3 mm, Pitch 0.95 mm; Code_JEDEC: TO-236; Eco-Plan: Green (RoHS & no Sb/Br); ComponentLink2Description: Datasheet; PackageReference: DBZ0003A; PackageVersion: 4203227/B; ComponentLink3Description: Package Specification; PartNumber: TLV431AIDBZR; ComponentLink1Description: Manufacturer URL
U27-U29 = MCP4725: 单通道DAC
U? = TLV3501: 高速比较器; BOM名称: 单路精密运放; 版权归属: 源创客; 学习资源: www.ooocke.com

## Sheet AtoD_PART.SchDoc
size A4; SheetNumber: 3; SheetTotal: 3
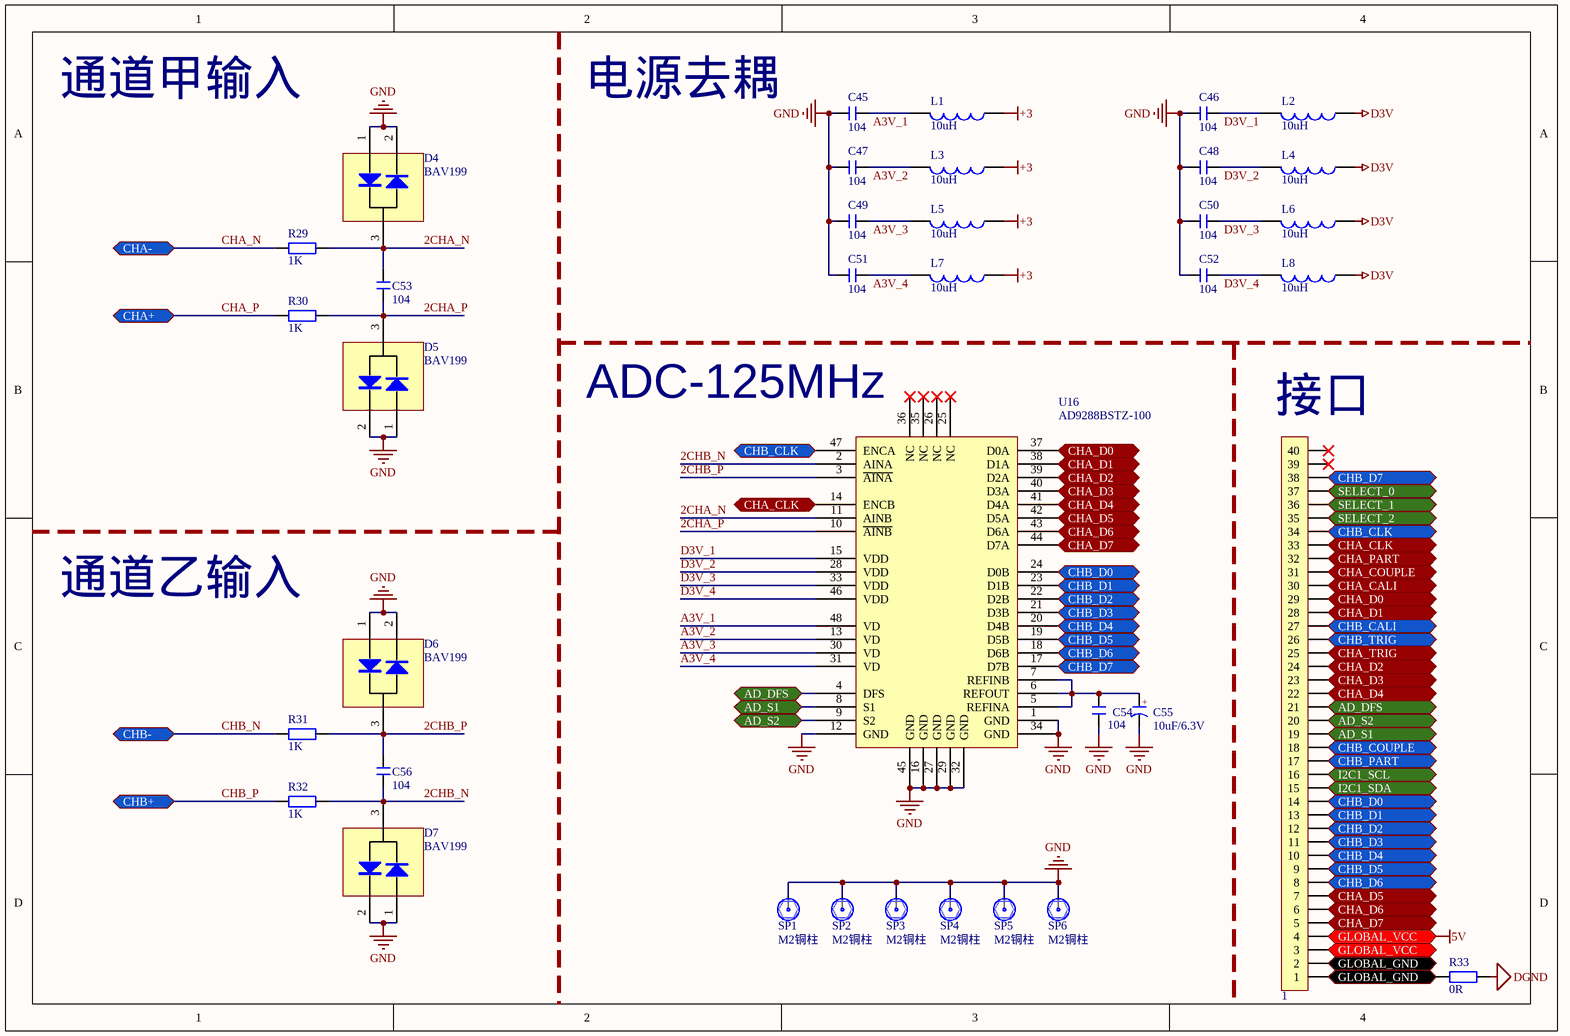
[diagram p2: AtoD_PART.SchDoc]

### Parts
1  FPC1.0-40P  [FPC0.5 2H-WS-40P]  (value not drawn)
C45  104  [C 0603_L]
C46  104  [C 0603_L]
C47  104  [C 0603_L]
C48  104  [C 0603_L]
C49  104  [C 0603_L]
C50  104  [C 0603_L]
C51  104  [C 0603_L]
C52  104  [C 0603_L]
C53  104  [C 0603_L]
C54  104  [C 0603_L]
C55  10uF/6.3V  [C 0603_L]
C56  104  [C 0603_L]
D4  BAV199  [SOT23-3L]
D5  BAV199  [SOT23-3L]
D6  BAV199  [SOT23-3L]
D7  BAV199  [SOT23-3L]
L1  10uH  [L 0603_L]
L2  10uH  [L 0603_L]
L3  10uH  [L 0603_L]
L4  10uH  [L 0603_L]
L5  10uH  [L 0603_L]
L6  10uH  [L 0603_L]
L7  10uH  [L 0603_L]
L8  10uH  [L 0603_L]
R29  1K  [R 0603_L]
R30  1K  [R 0603_L]
R31  1K  [R 0603_L]
R32  1K  [R 0603_L]
R33  0R  [R 0603_L]
SP1  M2铜柱  [M2]
SP2  M2铜柱  [M2]
SP3  M2铜柱  [M2]
SP4  M2铜柱  [M2]
SP5  M2铜柱  [M2]
SP6  M2铜柱  [M2]
U16  AD9288BSTZ-100  [TQFP48 7x7_L]

### Ports
AD_DFS (bidir), AD_S1 (bidir), AD_S2 (bidir), CHA+ (bidir), CHA- (bidir), CHA_CALI (bidir), CHA_CLK (bidir), CHA_COUPLE (bidir), CHA_D0 (bidir), CHA_D1 (bidir), CHA_D2 (bidir), CHA_D3 (bidir), CHA_D4 (bidir), CHA_D5 (bidir), CHA_D6 (bidir), CHA_D7 (bidir), CHA_PART (bidir), CHA_TRIG (bidir), CHB+ (bidir), CHB- (bidir), CHB_CALI (bidir), CHB_CLK (bidir), CHB_COUPLE (bidir), CHB_D0 (bidir), CHB_D1 (bidir), CHB_D2 (bidir), CHB_D3 (bidir), CHB_D4 (bidir), CHB_D5 (bidir), CHB_D6 (bidir), CHB_D7 (bidir), CHB_PART (bidir), CHB_TRIG (bidir), GLOBAL_GND (bidir), GLOBAL_VCC (bidir), I2C1_SCL (bidir), I2C1_SDA (bidir), SELECT_0 (bidir), SELECT_1 (bidir), SELECT_2 (bidir)

### Nets
5V: 1.3 1.4 ; port GLOBAL_VCC
+3: L1.1 L3.1 L5.1 L7.1
D3V: L2.1 L4.1 L6.1 L8.1
DGND: C45.1 C46.1 C47.1 C48.1 C49.1 C50.1 C51.1 C52.1 C54.1 C55.2(K) D4.1 D4.2 D5.1 D5.2 D6.1 D6.2 D7.1 D7.2 R33.1 SP1.1 SP2.1 SP3.1 SP4.1 SP5.1 SP6.1 U16.1(GND) U16.12(GND) U16.16(GND) U16.27(GND) U16.29(GND) U16.32(GND) U16.34(GND) U16.45(GND)  [also labelled GND]
2CHA_N: C53.1 D4.3 R29.2 U16.11(AINB)
2CHA_P: C53.2 D5.3 R30.2 U16.10(~{AINB})
2CHB_N: C56.2 D7.3 R32.2 U16.2(AINA)
2CHB_P: C56.1 D6.3 R31.2 U16.3(~{AINA})
A3V_1: C45.2 L1.2 U16.48(VD)
A3V_2: C47.2 L3.2 U16.13(VD)
A3V_3: C49.2 L5.2 U16.30(VD)
A3V_4: C51.2 L7.2 U16.31(VD)
CHA_N: R29.1 ; port CHA-
CHA_P: R30.1 ; port CHA+
CHB_N: R31.1 ; port CHB-
CHB_P: R32.1 ; port CHB+
D3V_1: C46.2 L2.2 U16.15(VDD)
D3V_2: C48.2 L4.2 U16.28(VDD)
D3V_3: C50.2 L6.2 U16.33(VDD)
D3V_4: C52.2 L8.2 U16.46(VDD)
Net1_1: 1.1 1.2 R33.2 ; port GLOBAL_GND
Net1_5: 1.5 U16.44(D7A) ; port CHA_D7
Net1_6: 1.6 U16.43(D6A) ; port CHA_D6
Net1_7: 1.7 U16.42(D5A) ; port CHA_D5
Net1_8: 1.8 U16.18(D6B) ; port CHB_D6
Net1_9: 1.9 U16.19(D5B) ; port CHB_D5
Net1_10: 1.10 U16.20(D4B) ; port CHB_D4
Net1_11: 1.11 U16.21(D3B) ; port CHB_D3
Net1_12: 1.12 U16.22(D2B) ; port CHB_D2
Net1_13: 1.13 U16.23(D1B) ; port CHB_D1
Net1_14: 1.14 U16.24(D0B) ; port CHB_D0
Net1_15: 1.15 ; port I2C1_SDA
Net1_16: 1.16 ; port I2C1_SCL
Net1_17: 1.17 ; port CHB_PART
Net1_18: 1.18 ; port CHB_COUPLE
Net1_19: 1.19 U16.8(S1) ; port AD_S1
Net1_20: 1.20 U16.9(S2) ; port AD_S2
Net1_21: 1.21 U16.4(DFS) ; port AD_DFS
Net1_22: 1.22 U16.41(D4A) ; port CHA_D4
Net1_23: 1.23 U16.40(D3A) ; port CHA_D3
Net1_24: 1.24 U16.39(D2A) ; port CHA_D2
Net1_25: 1.25 ; port CHA_TRIG
Net1_26: 1.26 ; port CHB_TRIG
Net1_27: 1.27 ; port CHB_CALI
Net1_28: 1.28 U16.38(D1A) ; port CHA_D1
Net1_29: 1.29 U16.37(D0A) ; port CHA_D0
Net1_30: 1.30 ; port CHA_CALI
Net1_31: 1.31 ; port CHA_COUPLE
Net1_32: 1.32 ; port CHA_PART
Net1_33: 1.33 U16.14(ENCB) ; port CHA_CLK
Net1_34: 1.34 U16.47(ENCA) ; port CHB_CLK
Net1_35: 1.35 ; port SELECT_2
Net1_36: 1.36 ; port SELECT_1
Net1_37: 1.37 ; port SELECT_0
Net1_38: 1.38 U16.17(D7B) ; port CHB_D7
NetC54_2: C54.2 C55.1(A) U16.5(REFINA) U16.6(REFOUT) U16.7(REFINB)

Not connected (* = marked no-connect by the designer): 1 39* 40*; U16 25(NC)* 26(NC)* 35(NC)* 36(NC)*

### Notes on the sheet
- 通道甲输入
- 电源去耦
- (near U16) ADC-125MHz
- (near 1) 接口
- 通道乙输入
- (in symbol C-CD) +

### Library data of the parts
1 = FPC-40P: FPC连接器; 版权归属: 源创客; BOM名称: FPC连接器; 学习资源: www.ooocke.com
C45-C54 C56 = C: 无极性贴片电容; 版权归属: 源创客; BOM名称: 无极性贴片电容; 学习资源: www.ooocke.com
C55 = C-CD: 贴片钽电容; 版权归属: 源创客; BOM名称: 贴片钽电容; 学习资源: www.ooocke.com
D4-D7 = BAV199: as D2 on sheet ANALOG_PART1; 学习资源: www.ooocke.com
L1-L8 = L: 小功率贴片电感; 版权归属: 源创客; BOM名称: 小功率贴片电感; 学习资源: www.ooocke.com
R29-R33 = R: 贴片电阻; 版权归属: 源创客; BOM名称: 贴片电阻; 学习资源: www.ooocke.com
SP1-SP6 = M2铜柱: BOM名称: 铜柱; 版权归属: 源创客; 学习资源: www.ooocke.com
U16 = AD9288BSTZ-100: 并行双通道高速ADC

## Nets that join several sheets
5V: ANALOG_PART1 (7 pins), AtoD_PART (1.3 1.4)
+3: ANALOG_PART1 (21 pins), ANALOG_PART2 (21 pins), AtoD_PART (L1.1 L3.1 L5.1 L7.1)
-2V5: ANALOG_PART1 (7 pins), ANALOG_PART2 (B20.1 B21.1 B22.1 B25.2)
D3V: ANALOG_PART1 (C32.1 U9.5), AtoD_PART (L2.1 L4.1 L6.1 L8.1)
DGND: ANALOG_PART1 (70 pins), ANALOG_PART2 (60 pins), AtoD_PART (33 pins)
CHA_N: ANALOG_PART1 (R14.2 U5.4), AtoD_PART (R29.1)
CHA_P: ANALOG_PART1 (R1.2 U5.5), AtoD_PART (R30.1)
CHB_N: ANALOG_PART2 (R47.2 U21.4), AtoD_PART (R31.1)
CHB_P: ANALOG_PART2 (R34.2 U21.5), AtoD_PART (R32.1)
Net1_15: ANALOG_PART1 (U13.4 U14.4 U15.4), ANALOG_PART2 (U27.4 U28.4 U29.4), AtoD_PART (1.15)
Net1_16: ANALOG_PART1 (U13.5 U14.5 U15.5), ANALOG_PART2 (U27.5 U28.5 U29.5), AtoD_PART (1.16)
Net1_17: ANALOG_PART2 (R46.2), AtoD_PART (1.17)
Net1_18: ANALOG_PART2 (R41.1), AtoD_PART (1.18)
Net1_25: ANALOG_PART1 (U10.6), AtoD_PART (1.25)
Net1_26: ANALOG_PART2 (U?.6), AtoD_PART (1.26)
Net1_27: ANALOG_PART2 (R49.2), AtoD_PART (1.27)
Net1_30: ANALOG_PART1 (R16.2), AtoD_PART (1.30)
Net1_31: ANALOG_PART1 (R8.1), AtoD_PART (1.31)
Net1_32: ANALOG_PART1 (R13.2), AtoD_PART (1.32)
Net1_35: ANALOG_PART2 (IC1.3), AtoD_PART (1.35)
Net1_36: ANALOG_PART2 (IC1.2), AtoD_PART (1.36)
Net1_37: ANALOG_PART2 (IC1.1), AtoD_PART (1.37)
NetIC1_13: ANALOG_PART1 (U13.6), ANALOG_PART2 (IC1.13)
NetIC1_14: ANALOG_PART1 (U15.6), ANALOG_PART2 (IC1.14)
NetIC1_15: ANALOG_PART1 (U14.6), ANALOG_PART2 (IC1.15)
NetU1_6: ANALOG_PART1 (U1.6 U2.3), ANALOG_PART2 (U17.5)